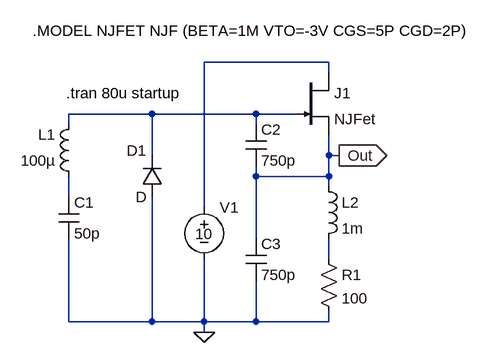
[diagram p0: schematic Clapp.asc]
Clapp.asc, the LTspice schematic file:
Version 4
SHEET 1 880 680
WIRE -208 272 -208 256
WIRE -208 384 -208 352
WIRE -208 576 -208 448
WIRE -80 256 -208 256
WIRE -80 320 -80 256
WIRE -80 576 -208 576
WIRE -80 576 -80 384
WIRE 0 400 0 176
WIRE 0 576 -80 576
WIRE 0 576 0 480
WIRE 0 592 0 576
WIRE 80 256 -80 256
WIRE 80 272 80 256
WIRE 80 352 80 336
WIRE 80 448 80 352
WIRE 80 576 0 576
WIRE 80 576 80 512
WIRE 144 256 80 256
WIRE 192 176 0 176
WIRE 192 192 192 176
WIRE 192 320 192 288
WIRE 192 352 80 352
WIRE 192 352 192 320
WIRE 192 368 192 352
WIRE 192 480 192 448
WIRE 192 576 80 576
WIRE 192 576 192 560
WIRE 208 320 192 320
FLAG 0 592 0
FLAG 208 320 Out
IOPIN 208 320 Out
SYMBOL diode -64 384 R180
WINDOW 0 24 72 Left 0
WINDOW 3 24 0 Left 0
SYMATTR InstName D1
SYMBOL njf 144 192 R0
SYMATTR InstName J1
SYMATTR Value NJFet
SYMBOL ind 176 352 R0
SYMATTR InstName L2
SYMATTR Value 1m
SYMBOL res 176 464 R0
SYMATTR InstName R1
SYMATTR Value 100
SYMBOL cap 64 272 R0
SYMATTR InstName C2
SYMATTR Value 750p
SYMBOL ind -192 368 R180
WINDOW 0 36 80 Left 0
WINDOW 3 36 40 Left 0
SYMATTR InstName L1
SYMATTR Value 100µ
SYMBOL cap -224 384 R0
SYMATTR InstName C1
SYMATTR Value 50p
SYMBOL voltage 0 384 R0
WINDOW 3 -14 57 Left 0
WINDOW 123 0 0 Left 0
WINDOW 39 -23 96 VRight 0
SYMATTR Value 10
SYMATTR InstName V1
SYMBOL cap 64 448 R0
SYMATTR InstName C3
SYMATTR Value 750p
TEXT -212 224 Left 0 !.tran 80u startup
TEXT -264 128 Left 0 !.MODEL NJFET NJF (BETA=1M VTO=-3V CGS=5P CGD=2P)

The netlist it stands for:
* Clapp.asc
D1 0 N001 D
J1 N003 N001 Out NJFet
L2 Out N004 1m
R1 N004 0 100
C2 N001 Out 750p
L1 N002 N001 100µ
C1 N002 0 50p
V1 N003 0 10
C3 Out 0 750p
.model D D
.lib standard.dio
.model NJF NJF
.model PJF PJF
.lib standard.jft
.tran 80u startup
.MODEL NJFET NJF (BETA=1M VTO=-3V CGS=5P CGD=2P)
.backanno
.end